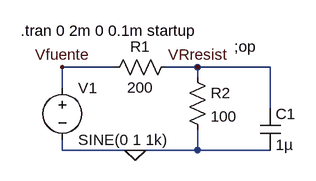
[diagram p0: schematic ltspicecurso1.asc]
ltspicecurso1.asc, the LTspice schematic file:
Version 4
SHEET 1 880 680
WIRE 160 80 80 80
WIRE 288 80 240 80
WIRE 400 80 288 80
WIRE 288 96 288 80
WIRE 80 112 80 80
WIRE 400 144 400 80
WIRE 80 208 80 192
WIRE 192 208 80 208
WIRE 288 208 288 176
WIRE 288 208 192 208
WIRE 400 208 288 208
FLAG 192 208 0
FLAG 80 80 Vfuente
FLAG 288 80 VRresist
SYMBOL voltage 80 96 R0
WINDOW 123 0 0 Left 2
WINDOW 39 0 0 Left 2
SYMATTR InstName V1
SYMATTR Value SINE(0 1 1k)
SYMBOL res 144 96 R270
WINDOW 0 32 56 VTop 2
WINDOW 3 0 56 VBottom 2
SYMATTR InstName R1
SYMATTR Value 200
SYMBOL res 272 80 R0
SYMATTR InstName R2
SYMATTR Value 100
SYMBOL cap 384 144 R0
SYMATTR InstName C1
SYMATTR Value 1µ
TEXT 344 48 Left 2 !;op
TEXT 16 24 Left 2 !.tran 0 2m 0 0.1m startup

The netlist it stands for:
* ltspicecurso1.asc
V1 Vfuente 0 SINE(0 1 1k)
R1 Vfuente VRresist 200
R2 VRresist 0 100
C1 VRresist 0 1µ
;op
.tran 0 2m 0 0.1m startup
.backanno
.end